# EAGLE design USBControlledAudioMixer (EAGLE 6.6.0)
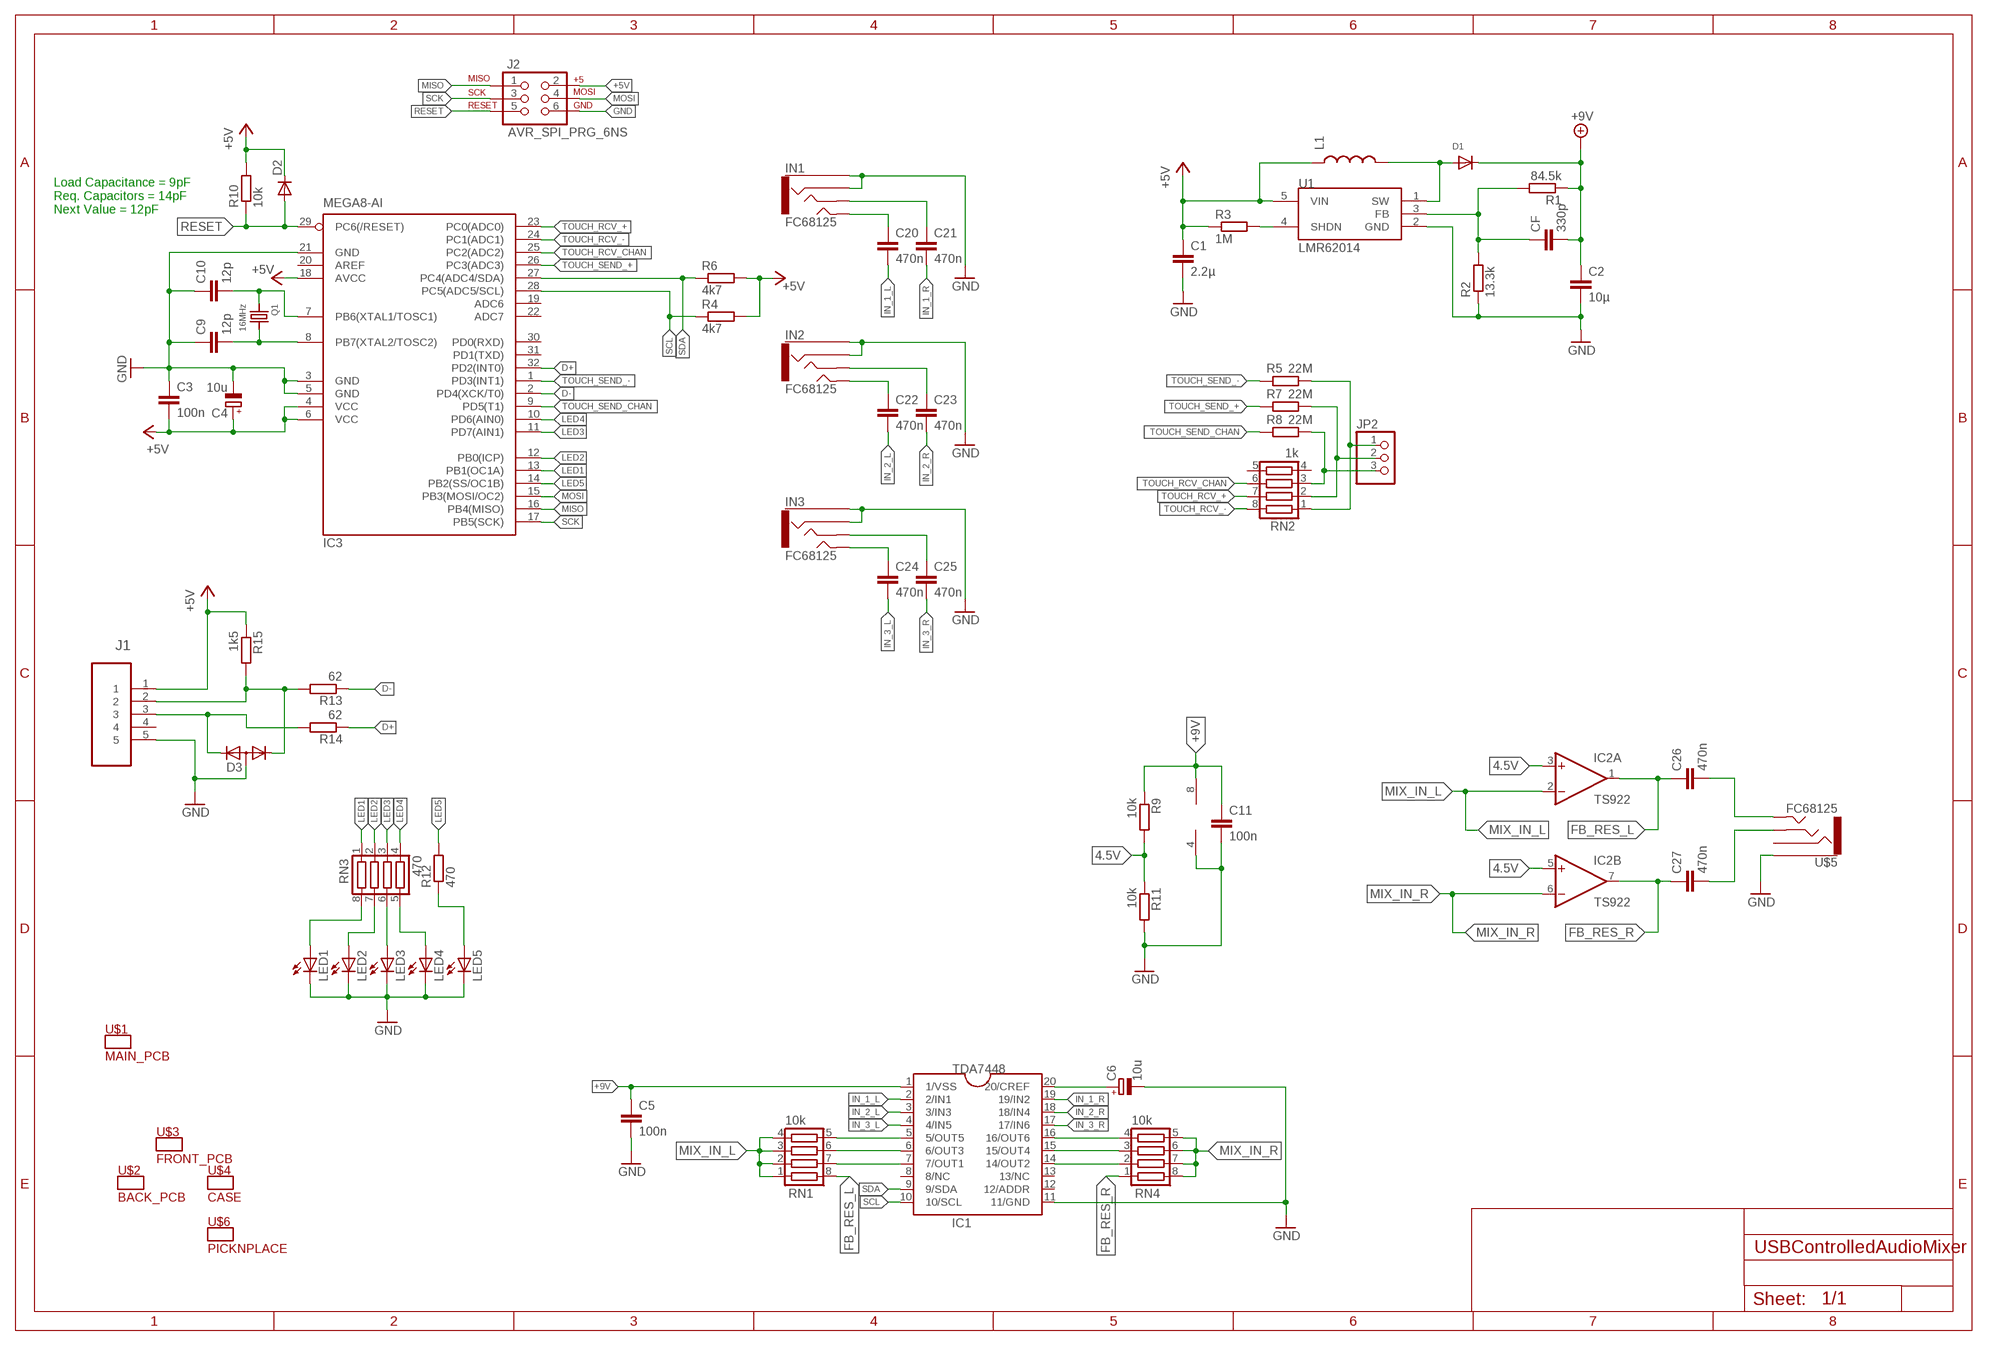
[diagram p0: schematic, sheet 1]
U$1 (DUMMY): PRICE_100: 2
U$2 (DUMMY): PRICE_100: 2
U$3 (DUMMY): PRICE_100: 2
U$4 (DUMMY): PRICE_100: 2
U$6 (DUMMY): PRICE_100: 5

## Parts
C1  2.2µ  C-EUC0603  [C0603]
C2  10µ  C-EUC0805  [C0805]
C3  100n  C-EUC0603  [C0603]
C4  10u  CPOL-EUSMCA  [SMC_A]
C5  100n  C-EUC0603  [C0603]
C6  10u  CPOL-EUSMCA  [SMC_A]
C9  12p  C-EUC0603  [C0603]
C10  12p  C-EUC0603  [C0603]
C11  100n  C-EUC0603  [C0603]
C20  470n  C-EUC1206  [C1206]
C21  470n  C-EUC1206  [C1206]
C22  470n  C-EUC1206  [C1206]
C23  470n  C-EUC1206  [C1206]
C24  470n  C-EUC1206  [C1206]
C25  470n  C-EUC1206  [C1206]
C26  470n  C-EUC1206  [C1206]
C27  470n  C-EUC1206  [C1206]
CF  330p  C-EUC0603  [C0603]
D1  DIODESOD-123  [SOD-123]
D2  DIODE-SOD323-R  [SOD323-R]
D3  DIODE-2CA|ACSOT23  [SOT23]
IC1  TDA7448  [SO20]
IC2  TS922  LM358D  [SO08]
IC3  MEGA8-AI  [TQFP32-08]
IN1  FC68125  [FC68125]
IN2  FC68125  [FC68125]
IN3  FC68125  [FC68125]
J1  47346-0001  [MOLEX_47346-0001]
J2  AVR_SPI_PRG_6NS  [2X3-NS]
JP2  PINHD-1X3  [1X03/90_MOLEX_4094]
L1  INDUCTOR1007  [1007]
LED1  LED0603  [LED-0603]
LED2  LED0603  [LED-0603]
LED3  LED0603  [LED-0603]
LED4  LED0603  [LED-0603]
LED5  LED0603  [LED-0603]
Q1  16MHz  CRYSTALTHIN  [CRYSTAL_3.2X2.5]
R1  84.5k  R-EU_R0603  [R0603]
R2  13.3k  R-EU_R0603  [R0603]
R3  1M  R-EU_R0603  [R0603]
R4  4k7  R-EU_R0603  [R0603]
R5  22M  R-EU_R0603  [R0603]
R6  4k7  R-EU_R0603  [R0603]
R7  22M  R-EU_R0603  [R0603]
R8  22M  R-EU_R0603  [R0603]
R9  10k  R-EU_R0603  [R0603]
R10  10k  R-EU_R0603  [R0603]
R11  10k  R-EU_R0603  [R0603]
R12  470  R-EU_R0603  [R0603]
R13  62  R-EU_R0603  [R0603]
R14  62  R-EU_R0603  [R0603]
R15  1k5  R-EU_R0603  [R0603]
RN1  10k  RES_ARR  [YC164]
RN2  1k  RES_ARR  [YC164]
RN3  470  RES_ARR  [YC164]
RN4  10k  RES_ARR  [YC164]
U1  LMR62014  [SOT-23]
U$5  FC68125  [FC68125]

## Nets
4.5V: IC2.3(A:+IN) IC2.5(B:+IN) R9.2 R11.1
+5V [supply]: C1.1 C3.2 C4.+ D2.C IC3.4(VCC) IC3.6(VCC) IC3.18(AVCC) J1.1 J2.2 L1.1 R3.1 R4.2 R6.2 R10.2 R15.1 U1.5(VIN)
+9V: C2.1 C5.1 C11.1 CF.2 D1.C IC1.1(1/VSS) IC2.8(P:V+) R1.1 R9.1
D+: IC3.32(PD2(INT0)) R14.1
D-: IC3.2(PD4(XCK/T0)) R13.1
FB: CF.1 R1.2 R2.2 U1.3(FB)
FB_RES_L: C26.1 IC2.1(A:OUT) RN1.8
FB_RES_R: C27.1 IC2.7(B:OUT) RN4.1
GND: C1.2 C2.2 C3.1 C4.- C5.2 C6.- C9.1 C10.1 C11.2 D3.3(A) IC1.11(11/GND) IC2.4(P:V-) IC3.3(GND) IC3.5(GND) IC3.21(GND) IN1.1 IN1.6 IN2.1 IN2.6 IN3.1 IN3.6 J1.5 J2.6 LED1.C LED2.C LED3.C LED4.C LED5.C R2.1 R11.2 U1.2(GND) U$5.1
IN_1_L: C20.2 IC1.2(2/IN1)
IN_1_R: C21.2 IC1.19(19/IN2)
IN_2_L: C22.2 IC1.3(3/IN3)
IN_2_R: C23.2 IC1.18(18/IN4)
IN_3_L: C24.2 IC1.4(4/IN5)
IN_3_R: C25.2 IC1.17(17/IN6)
LED1: IC3.13(PB1(OC1A)) RN3.1
LED2: IC3.12(PB0(ICP)) RN3.2
LED3: IC3.11(PD7(AIN1)) RN3.3
LED4: IC3.10(PD6(AIN0)) RN3.4
LED5: IC3.14(PB2(SS/OC1B)) R12.2
MISO: IC3.16(PB4(MISO)) J2.1
MIX_IN_L: IC2.2(A:-IN) RN1.1 RN1.2 RN1.3 RN1.4
MIX_IN_R: IC2.6(B:-IN) RN4.5 RN4.6 RN4.7 RN4.8
MOSI: IC3.15(PB3(MOSI/OC2)) J2.4
N$1: C6.+ IC1.20(20/CREF)
N$2: C9.2 IC3.8(PB7(XTAL2/TOSC2)) Q1.2
N$3: C10.2 IC3.7(PB6(XTAL1/TOSC1)) Q1.1
N$5: LED1.A RN3.8
N$6: LED2.A RN3.7
N$7: LED3.A RN3.6
N$8: LED4.A RN3.5
N$9: LED5.A R12.1
N$10: C24.1 IN3.2
N$11: D3.1(K1) J1.2 R13.2 R15.2
N$12: C25.1 IN3.3 IN3.3A
N$13: D3.2(K2) J1.3 R14.2
N$14: C22.1 IN2.2
N$15: C23.1 IN2.3 IN2.3A
N$16: C20.1 IN1.2
N$17: C21.1 IN1.3 IN1.3A
N$18: JP2.1 R5.2 RN2.1
N$19: JP2.2 R7.2 RN2.2
N$20: JP2.3 R8.2 RN2.3
N$21: IC1.5(5/OUT5) RN1.5
N$22: IC1.6(6/OUT3) RN1.6
N$23: C26.2 U$5.2
N$25: IC1.7(7/OUT1) RN1.7
N$26: C27.2 U$5.3 U$5.3A
N$27: IC1.16(16/OUT6) RN4.4
N$28: IC1.15(15/OUT4) RN4.3
N$29: IC1.14(14/OUT2) RN4.2
RESET: D2.A IC3.29(PC6(/RESET)) J2.5 R10.1
SCK: IC3.17(PB5(SCK)) J2.3
SCL: IC1.10(10/SCL) IC3.28(PC5(ADC5/SCL)) R4.1
SDA: IC1.9(9/SDA) IC3.27(PC4(ADC4/SDA)) R6.1
SHDN: R3.2 U1.4(SHDN)
SW: D1.A L1.2 U1.1(SW)
TOUCH_RCV_+: IC3.23(PC0(ADC0)) RN2.7
TOUCH_RCV_-: IC3.24(PC1(ADC1)) RN2.8
TOUCH_RCV_CHAN: IC3.25(PC2(ADC2)) RN2.6
TOUCH_SEND_+: IC3.26(PC3(ADC3)) R7.1
TOUCH_SEND_-: IC3.1(PD3(INT1)) R5.1
TOUCH_SEND_CHAN: IC3.9(PD5(T1)) R8.1
Unconnected: IC1.8(8/NC) IC1.12(12/ADDR) IC1.13(13/NC) IC3.19(ADC6) IC3.20(AREF) IC3.22(ADC7) IC3.30(PD0(RXD)) IC3.31(PD1(TXD)) J1.4 RN2.4 RN2.5 U$5.6

## Notes on the sheet
- Load Capacitance = 9pF
  Req. Capacitors = 14pF
  Next Value = 12pF

## Library data of the parts
C1 = rcl:C-EU: CAPACITOR, European symbol; OC_DIGIKEY: 1276-1821-1-ND; PRICE_100: 0.039
C2 = rcl:C-EU: CAPACITOR, European symbol; OC_DIGIKEY: 490-10498-1-ND; PRICE_100: 0.067
C3 C5 C11 = rcl:C-EU: CAPACITOR, European symbol; OC_DIGIKEY: 1276-1258-1-ND; PRICE_100: 0.008
C4 C6 = rcl:CPOL-EU: POLARIZED CAPACITOR, European symbol; OC_TME: T491A106M016AT; PRICE_100: 0.064
C9 C10 = rcl:C-EU: CAPACITOR, European symbol; OC_DIGIKEY: 1276-1254-1-ND; PRICE_100: 0.013
C20-C27 = rcl:C-EU: CAPACITOR, European symbol; OC_DIGIKEY: 338-2776-1-ND; PRICE_100: 0.487
CF = rcl:C-EU: CAPACITOR, European symbol; OC_DIGIKEY: 1276-2272-1-ND; PRICE_100: 0.02
D1 = adafruit:DIODE: Diode SMADIODE - SMA Surface Mount Package 20V 1A Schottky Diode Digikey: 641-1014-6-ND DO-1N4148 - Through Hole Small Current Diode SOD-123 20V 1 A (.5mV Vf) Schottky Diode - Digikey: MBRX120TPMSCT-ND SOD-323 10V 570mA (.38mV Vf, 3ns) Schottky Diode - Digikey: ZLLS410CT-ND SOD-523 30V 30mA Schottky Diode (RB751S-40TE61) - Digikey: RB751S-40TE61CT-ND SOT23-R/W - SOT23 Package (R = Solder Paste/Reflow Ovens, W = Hand-Soldering) BAT54Film 40V 300mA - Digikey: 497-7162-1-ND; OC_DIGIKEY: MBR0520LT1GOSCT-ND; PRICE_100: 0.18
D2 = diode:DIODE-: DIODE; OC_DIGIKEY: 497-10893-1-ND; PRICE_100: 0.092
D3 = diode:DIODE-2CA|AC: Dual DIODE Cathode-Anode|Anode-Cathode; OC_DIGIKEY: AZ23C3V6-TPMSCT-ND; PRICE_100: 0.16
IC1 = Audio-Power-amlifier V.2.0:TDA7448: The TDA7448 is a 6 channel volume controller for quality audio applications in Multi-Channels Audio Systems; OC_DIGIKEY: 497-8884-1-ND; PRICE_100: 2.35
IC2 = linear:LM358: OP AMP also LM158; LM258; LM2904 Source: http://cache.national.com/ds/LM/LM158.pdf; OC_DIGIKEY: 497-6035-1-ND; PRICE_100: 0.546
IC3 = atmel:MEGA8: MICROCONTROLLER 8 Kbytes FLASH, 1 kbytes SRAM, 512 bytes EEPROM, USART, 6-channel 10 bit ADC, 2-channel 8 bit ADC Pin compatible with Atmega48, ATMega88, ATMega168 Source: avr.lbr; MPN: ATMEGA8-16AU; OC_FARNELL: 9171371; OC_NEWARK: 73M8863; OC_TME: ATMEGA8-16AU; PRICE_100: 1.04
IN1-IN3 U$5 = FC68125:FC68125; OC_TME: FC68125; PRICE_100: 0.313
J1 = Molex-47346-0001:47346-0001: CONN RCPT 5POS MICRO USB R/A SMD; MPN: 47346-0001; OC_DIGIKEY: WM17141CT-ND; OC_FARNELL: 1568026; OC_NEWARK: 47M0505; PACKAGE: 5 POS MICRO USB R/A; PRICE_100: 0.74; SUPPLIER: MOLEX
J2 = SparkFun:AVR_SPI_PRG_6: AVR ISP 6 Pin This is the reduced ISP connector for AVR programming. Common on Arduino. This footprint will take up less PCB space and can be used with a 10-pin to 6-pin adapter such as SKU: BOB-08508
JP2 = TinyMix3:PINHD-1X3: PIN HEADER; OC_DIGIKEY: WM2734-ND; PRICE_100: 0.227
L1 = SparkFun:INDUCTOR: Inductors Basic Inductor/Choke - 0603 and 1206. Footprints are not proven and vary greatly between part numbers.; OC_DIGIKEY: 587-1613-1-ND; PRICE_100: 0.14
LED1-LED5 = SparkFun:LED: LEDs Standard schematic elements and footprints for 5mm, 3mm, 1206, and 0603 sized LEDs. 5mm - Spark Fun Electronics SKU : COM-00529 (and others); OC_TME: KPA-1606QBC-F; PRICE_100: 0.2511
Q1 = nonolith:CRYSTAL: Crystals HC49UP - Surface Mount Crystal 4.0MHz 18pF +/-30ppm Surface Mount Crystal [Digikey: 535-9857-1-ND] 12.0 MHz Surface Mount Crystal [Digikey: 535-9869-6-ND] 25.0 MHz Surface Mount Crystal [Digikey: 535-9078-1-ND] 3.2 x 2.5mm - MEMs SMT Crystal 12.0 MHz 8pF 15ppm 3.2 x 2.5mm Crystal [Digikey: 644-1047-1-ND] 16.0 MHz 8pF 15ppm 3.2 x 2.5mm Crystal [Digikey: 644-1049-1-ND] 16.0 MHz 10pF 10ppm 3.2 x 2.5mm Crystal [Digikey: 644-1100-1-ND] 27.12 MHz 18pF 30ppm 3.2 x 2.5mm Crystal [Digikey: 887-1424-1-ND] 4.9 x 1.8mm - MEMs SMT Crystal 32.768 KHz 12.5pF 20ppm 4.9 x 1.8mm Crystal [Digikey: SE2415CT-ND] Cylinder 32.768KHz Cylinder Crystal; OC_DIGIKEY: SER3628CT-ND; PRICE_100: 0.415
R1 = rcl:R-EU_: RESISTOR, European symbol; OC_DIGIKEY: RHM84.5KCFCT-ND; PRICE_100: 0.0048
R2 = rcl:R-EU_: RESISTOR, European symbol; OC_DIGIKEY: RHM13.3KCFCT-ND; PRICE_100: 0.0043
R3 = rcl:R-EU_: RESISTOR, European symbol; OC_DIGIKEY: RHM1MCGCT-ND; PRICE_100: 0.0043
R4 R6 = rcl:R-EU_: RESISTOR, European symbol; OC_DIGIKEY: RHM4.7KCGCT-ND; PRICE_100: 0.0043
R5 R7 R8 = rcl:R-EU_: RESISTOR, European symbol; OC_DIGIKEY: RMCF0603JT22M0CT-ND; PRICE_100: 0.0069
R9 R11 R15 = rcl:R-EU_: RESISTOR, European symbol; OC_DIGIKEY: RHM1.5KCGCT-ND; PRICE_100: 0.0043
R10 = rcl:R-EU_: RESISTOR, European symbol; OC_DIGIKEY: RHM10KCGCT-ND; PRICE_100: 0.0042
R12 = rcl:R-EU_: RESISTOR, European symbol; OC_DIGIKEY: RHM470CGCT-ND; PRICE_100: 0.0043
R13 R14 = rcl:R-EU_: RESISTOR, European symbol; OC_DIGIKEY: RHM62CGCT-ND; PRICE_100: 0.0043
RN1 RN4 = Simplex-rlc:RES_ARR: resistor chip array yageo YC164 series (8pin/4R); OC_DIGIKEY: YC164J-10KCT-ND; PRICE_100: 0.015
RN2 = Simplex-rlc:RES_ARR: resistor chip array yageo YC164 series (8pin/4R); OC_DIGIKEY: YC164J-1.0KCT-ND; PRICE_100: 0.015
RN3 = Simplex-rlc:RES_ARR: resistor chip array yageo YC164 series (8pin/4R); OC_DIGIKEY: YC164J-470CT-ND; PRICE_100: 0.015
U1 = projectLibrary:LMR62014; OC_DIGIKEY: LMR62014XMF/NOPBCT-ND; PRICE_100: 1.269

## Net classes
1 supply: width 0.254 mm

## Board
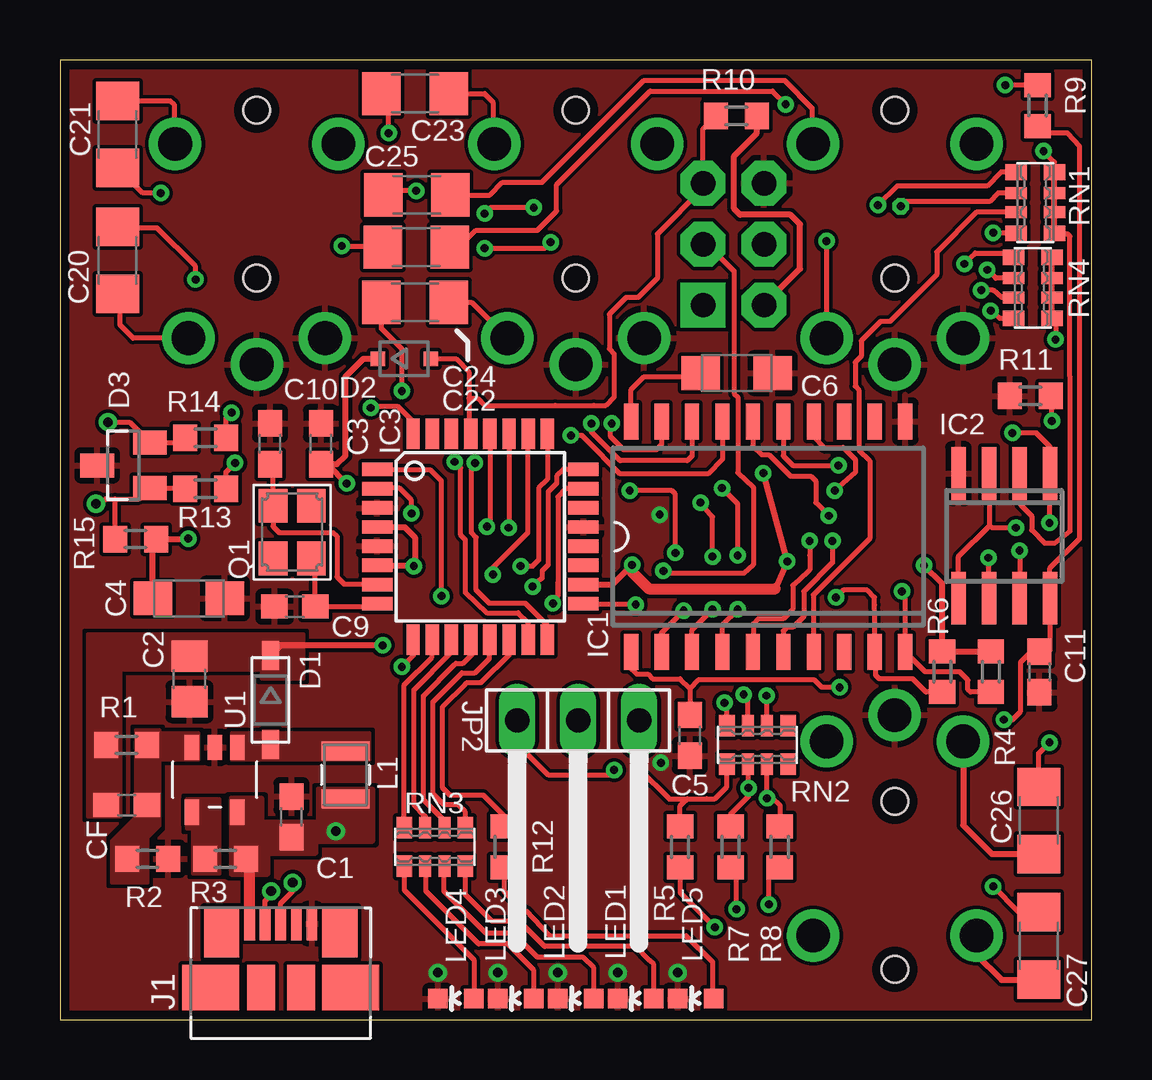
[diagram p1: board, top side]
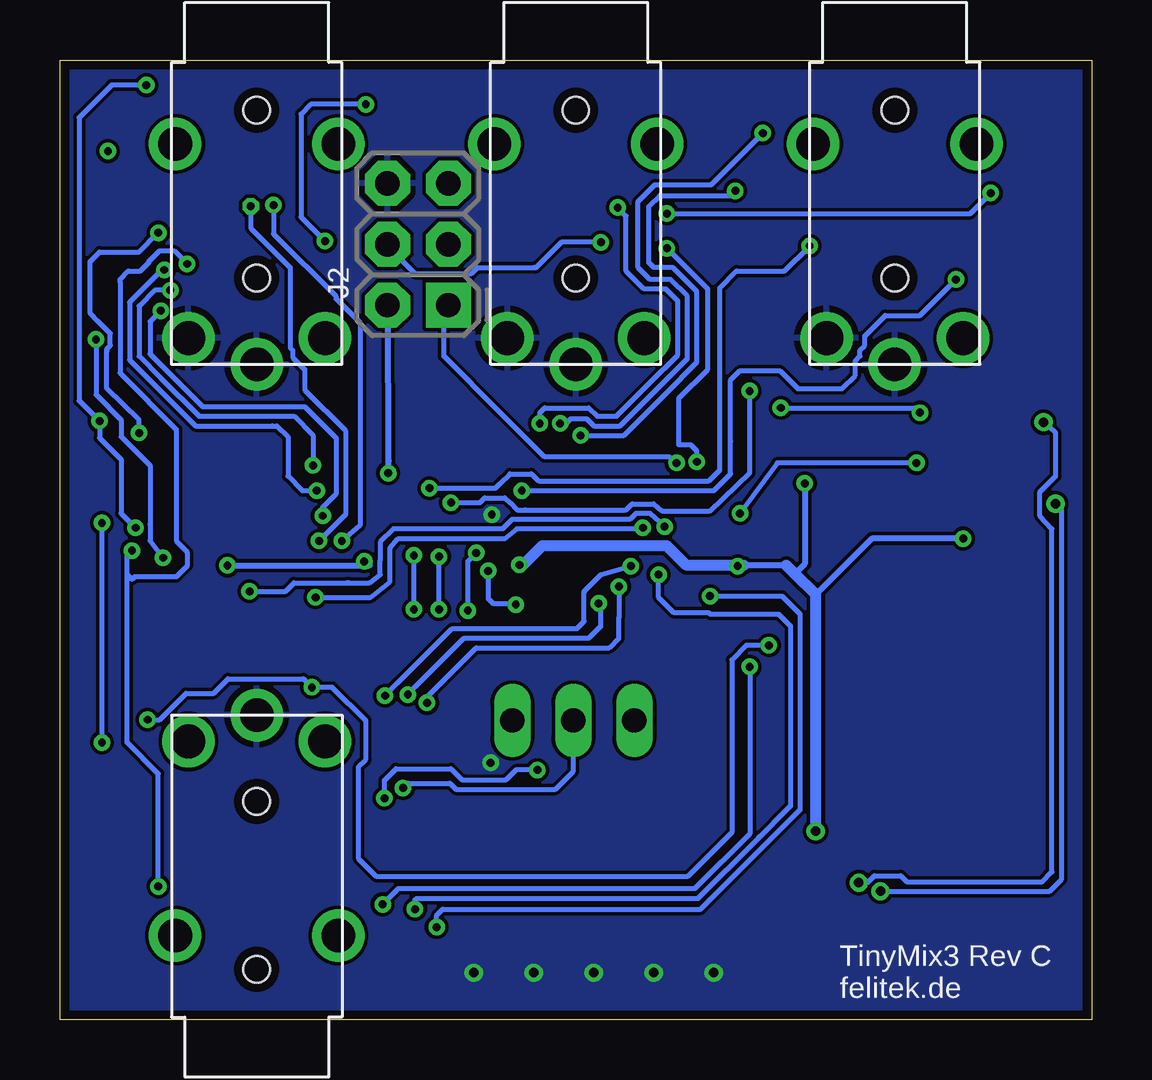
[diagram p2: board, bottom side, seen from below]

Size 43 x 40 mm. Coordinates in mm from the lower left corner, seen from the top.
Outline: 0,0 43,0 43,40 0,40 0,0
Copper layers (1*16): Top 0.0356mm / dielectric 1.5011mm / Bottom 0.0356mm
Design rules "LaenPCBOrder": minimum track width 6mil, minimum drill 13mil, track to track 6mil, track to pad 6mil, pad to pad 6mil, via to via 6mil, smd to smd 6mil, copper to edge 15mil, drill to drill 6mil, minimum pad ring 7mil, minimum via ring 7mil, stop-mask expansion 3mil, vias tented up to drill 0mil, thermal gap 10mil
tKeepout: area 0,0 to 1,40; area 42,0 to 43,40
bKeepout: area 0,0 to 1,40; area 42,0 to 43,40

### Footprints (pad centres in the part's own frame; a part is rotated, then mirrored left to right if it is on the bottom)
C0603 = smd 1.1 x 1: 1 -0.85,0; 2 0.85,0
C0805 = smd 1.3 x 1.5: 1 -0.95,0; 2 0.95,0
SMC_A = smd 1.6 x 1.4: + -1.5,0; - 1.5,0
C1206 = smd 1.6 x 1.8: 1 -1.4,0; 2 1.4,0
SOD-123 = smd 1.2 x 0.7: A 1.85,0; C -1.85,0
SOD323-R = smd 0.6 x 0.6: A 1.1,0; C -1.1,0
SOT23 = smd 1 x 1.4: 1 -0.95,-1.1; 2 0.95,-1.1; 3 0,1.1
SO20 = smd 0.6 x 1.5: 1 -5.715,-4.8; 2 -4.445,-4.8; 3 -3.175,-4.8; 4 -1.905,-4.8; 5 -0.635,-4.8; 6 0.635,-4.8; 7 1.905,-4.8; 8 3.175,-4.8; 9 4.445,-4.8; 10 5.715,-4.8; 11 5.715,4.8; 12 4.445,4.8; 13 3.175,4.8; 14 1.905,4.8; 15 0.635,4.8; 16 -0.635,4.8; 17 -1.905,4.8; 18 -3.175,4.8; 19 -4.445,4.8; 20 -5.715,4.8
SO08 = smd 0.6 x 2.2: 1 -1.905,-2.6; 2 -0.635,-2.6; 3 0.635,-2.6; 4 1.905,-2.6; 5 1.905,2.6; 6 0.635,2.6; 7 -0.635,2.6; 8 -1.905,2.6
TQFP32-08 = smd 1.27 x 0.559: 1 -4.293,2.8; 2 -4.293,2; 3 -4.293,1.2; 4 -4.293,0.4; 5 -4.293,-0.4; 6 -4.293,-1.2; 7 -4.293,-2; 8 -4.293,-2.8; 17 4.293,-2.8; 18 4.293,-2; 19 4.293,-1.2; 20 4.293,-0.4; 21 4.293,0.4; 22 4.293,1.2; 23 4.293,2; 24 4.293,2.8 | smd 0.559 x 1.27: 9 -2.8,-4.293; 10 -2,-4.293; 11 -1.2,-4.293; 12 -0.4,-4.293; 13 0.4,-4.293; 14 1.2,-4.293; 15 2,-4.293; 16 2.8,-4.293; 25 2.8,4.293; 26 2,4.293; 27 1.2,4.293; 28 0.4,4.293; 29 -0.4,4.293; 30 -1.2,4.293; 31 -2,4.293; 32 -2.8,4.293
FC68125 = drill 1.4 pad 2.184: 1 0,-6.35; 2 2.85,-5.25; 3 -3.4,2.85; 3A 3.4,2.85; 6 -2.85,-5.25 | hole 1.1: 0,4.25; 0,-2.75
MOLEX_47346-0001 = smd 0.45 x 1.38: 1 -1.3,0; 2 -0.65,0; 3 0,0; 4 0.65,0; 5 1.3,0 | smd 1.475 x 2.1: M1 -2.462,-0.36; M2 2.462,-0.36 | smd 2.375 x 1.9: M3 -2.913,-2.66; M6 2.913,-2.66 | smd 1.175 x 1.9: M4 -0.82,-2.66; M5 0.85,-2.66
2X3-NS = drill 1.016 pad 1.88 square: 1 -2.54,-1.27 | drill 1.016 pad 1.88 octagon: 2 -2.54,1.27; 3 0,-1.27; 4 0,1.27; 5 2.54,-1.27; 6 2.54,1.27
1X03/90_MOLEX_4094 = drill 1.016 long: 1 -2.54,-4.445; 2 0,-4.445; 3 2.54,-4.445
1007 = smd 2 x 0.8: 1 0,1; 2 0,-1
LED-0603 = smd 0.8 x 0.8: A 0,-0.75; C 0,0.75
CRYSTAL_3.2X2.5 = smd 1.4 x 1.2: 1 -1.1,-0.8; 2 1.1,0.8; GND1 -1.1,0.8; GND2 1.1,-0.8
R0603 = smd 1 x 1.1: 1 -0.85,0; 2 0.85,0
YC164 = smd 0.65 x 0.9: 1 -1.275,-0.8; 4 1.275,-0.8; 5 1.275,0.8; 8 -1.275,0.8 | smd 0.5 x 0.9: 2 -0.4,-0.8; 3 0.4,-0.8; 6 0.4,0.8; 7 -0.4,0.8
SOT-23 = smd 0.6 x 1.05: 1 -1,-1.4; 2 -0.05,-1.4; 3 0.9,-1.4; 4 0.9,1.3; 5 -1,1.3

### Placement (x,y rotation side)
C1  9.65,8.45 90 top
C2  5.4,14.2 270 top
C3  10.88,24 270 top
C4  5.37,17.56 0 top
C5  26.25,11.85 270 top
C6  28.2,26.95 0 top
C9  9.79,17.21 0 top
C10  8.75,24 270 top
C11  40.83,14.49 270 top
C20  2.4,31.65 90 top
C21  2.4,36.9 270 top
C22  14.8,29.9 180 top
C23  14.8,38.6 180 top
C24  14.85,32.2 180 top
C25  14.88,34.38 180 top
C26  40.8,8.3 270 top
C27  40.8,3.08 270 top
CF  2.77,8.95 180 top
D1  8.78,13.32 270 top
D2  14.35,27.55 0 top
D3  2.65,23.1 90 top
IC1  29.52,20.13 0 top
IC2  39.36,20.16 180 top
IC3  17.52,20.13 0 top
IN1  8.2,33.66 0 bottom
IN2  21.5,33.66 0 bottom
IN3  34.8,33.66 0 bottom
J1  9.2,4 0 top
J2  28.08,32.32 90 bottom
JP2  21.6,8.03 180 top
L1  11.9,10.2 180 top
LED1  24,0.88 90 top
LED2  21.5,0.88 90 top
LED3  19,0.88 90 top
LED4  16.5,0.88 90 top
LED5  26.5,0.88 90 top
Q1  9.68,20.32 270 top
R1  2.77,11.45 0 top
R2  3.65,6.7 180 top
R3  6.9,6.7 180 top
R4  38.8,14.5 90 top
R5  25.85,7.2 90 top
R6  36.77,14.5 90 top
R7  27.95,7.2 90 top
R8  30,7.2 90 top
R9  40.75,38.1 90 top
R10  28.2,37.66 0 top
R11  40.45,26 180 top
R12  18.5,7.2 90 top
R13  6.08,22.12 180 top
R14  6.08,24.25 180 top
R15  3.15,20.02 180 top
RN1  40.65,34.05 90 top
RN2  29.07,11.45 0 top
RN3  15.62,7.2 180 top
RN4  40.55,30.5 270 top
U1  6.4,9.95 180 top
U$5  34.8,6.34 180 bottom

### Tracks (layer width: path | path; a pad name or v marks a point on that pad's centre or on a via)
4.5V  (via drill 0.33)
  Top 0.203: IC2.5 37.45,19.3 38.75,20.6 | R9.2 v39.4,38.95 | v41.35,24.95 41.35,25.45 R11.1 | 38.75,20.6 38.75,22.73 IC2.3 | v39.85,20.5 38.85,20.5 38.75,20.6
  Bottom 0.203: v39.4,38.95 40.85,38.95 42.2,37.6 42.2,25.8 v41.35,24.95 41.35,24.25 40.45,23.35 40.45,21.1 v39.85,20.5
+5V  (via drill 0.33, 0.4)
  Top 0.254: IC3.18 23.03,18.13 v23.85,18.95 | IC3.6 13.26,18.9 v14.75,18.9 14.8,18.95 14.8,20.1 14.37,20.53 IC3.4 | C4.+ 3.87,19.89 R15.1 5.33,20.02 v5.35,20.05 | C3.2 11.15,23.15 | 11.15,23.15 v11.95,22.35 | J2.2 29.35,29.8 30.85,31.3 30.85,33.15 30.45,33.55 28.35,33.55 28.1,33.8 28.1,36 29.05,36.95 R10.2 | 29.82,17.95 v30.32,19.1 v29.32,22.78 | v36.02,18.93 36.77,18.18 R6.2 R4.2 | 11.15,23.15 11.55,23.15 11.9,23.5 11.9,26.35 11.9,26.8 12.65,27.55 D2.C
  Top 0.457: J1.1 7.9,6.55 R3.1 | v23.85,18.95 23.85,18.65 24.55,17.95 29.82,17.95
  Bottom 0.254: 12.72,18.93 14.5,18.93 14.53,18.9 v14.75,18.9 | v11.95,22.35 11.95,19 12.37,18.58 | v5.35,20.05 9.16,20.05 11.5,17.71 | v29.32,22.78 29.3,23.3 29.32,29.75 J2.2 | v36.02,18.93 30.09,18.93 v30.32,19.1
  Bottom 0.457: v11.5,7.85 11.5,17.71 12.37,18.58 12.72,18.93 | 14.5,18.93 16.88,18.93 17.7,19.75 22.9,19.75 23.7,18.95 23.73,18.93 v23.85,18.95
  pour Top (no thermals): 8.4,9.2 7.15,9.2 7.15,6.08 8.65,6.08 8.65,6.95 10.65,6.95 10.65,7.45 13.03,7.45 13.03,9.57 10.78,9.57 10.78,8.2 8.4,8.2
+9V  (via drill 0.33)
  Top 0.203: v32.5,13.85 31.75,13.85 31.45,14.15 26.6,14.15 26.25,13.8 | 26.25,13.8 C5.1 | R9.1 40.8,36.95 42,36.95 42.5,36.4 42.5,20.05 41.27,18.82 IC2.8 41.27,15.4 C11.1 41.27,15.4 40.55,15.4 40.05,14.9 40.05,12.85 39.7,12.5 v39.35,12.5 | 23.7,14.95 23.7,14.75 24.05,14.4 24.5,14.4 24.7,14.2 25.85,14.2 26.25,13.8
  Top 0.254: IC1.1 23.73,15.33 23.7,14.95 23.62,14.88 | v13.45,15.6 9.2,15.6 D1.C
  Bottom 0.203: v39.35,12.5 38.85,12.5 37.75,13.6 36.6,13.6 36,14.2 32.85,14.2 v32.5,13.85 31.65,13.85 30.25,12.45 30.25,10.85 30.55,10.55 30.55,6.7 29.8,5.95 16.85,5.95 15,7.8 15,15 14.4,15.6 v13.45,15.6
  pour Top (no thermals): 2.52,8.45 1.15,8.45 1.15,16.07 10.15,16.07 10.15,14.2 8.4,14.2 8.4,14.57 2.52,14.57
D+  (via drill 0.33)
  Top 0.203: R14.1 6.92,25.07 v7.15,25.3 | IC3.32 14.7,24.44 14.7,24.95 14.1,25.55 13,25.55 v12.95,25.5
  Bottom 0.203: v12.95,25.5 7.35,25.5 v7.15,25.3
D-  (via drill 0.33)
  Top 0.203: R13.1 6.92,22.82 v7.3,23.2 | 13.25,22.15 IC3.2 13.25,22.15 | v14.65,21.1 14.65,21.65 14.15,22.15 13.25,22.15
  Bottom 0.203: v7.3,23.2 13.1,23.2 v14.65,21.1
FB
  pour Top (no thermals): 3.65,5.7 3.65,7.58 4.15,8.07 4.15,10.82 5.78,10.82 5.78,11.95 4.15,11.95 4.15,12.07 3.15,12.07 3.15,8.45 2.15,7.45 2.15,5.7
FB_RES_L  (via drill 0.33)
  Top 0.203: C26.1 40.8,11.1 v41.25,11.55 | v41.25,20.7 41.25,22.75 IC2.1 41.27,23.89 40.7,24.45 v39.7,24.45 | v38.9,32.8 39.83,32.8 RN1.8
  Bottom 0.203: v41.25,11.55 v41.25,20.7 | v39.7,24.45 39.7,25 41.05,26.3 41.05,27.85 41.05,27.95 40.9,28.1 40.9,28.6 41.4,29.1 41.75,29.45 41.75,31.6 41.35,32 39.7,32 v38.9,32.8
FB_RES_R  (via drill 0.33)
  Top 0.203: C27.1 39.98,4.47 v38.9,5.55 | v40,19.55 40,19.57 IC2.7 | v37.7,31.5 37.98,31.77 38.15,31.95 39.58,31.95 RN4.1
  Bottom 0.203: v38.9,5.55 38.9,10.25 40.2,11.55 40.2,18.55 | 40.2,18.55 40.2,19.35 v40,19.55 | 40.2,18.55 40,18.35 39.9,18.45 38.15,18.45 37.7,18.9 37.7,19.5 38.15,19.95 38.15,24.6 40.5,26.95 40.5,30.75 40.5,30.85 40.15,31.2 39.65,31.2 39.3,31.55 39.3,31.6 38.85,32.05 38.25,32.05 v37.7,31.5
GND  (via drill 0.33, 0.4)
  other vias: 15.75,1.95 18.25,1.95 20.75,1.95 23.25,1.95 25.75,1.95 25.05,10.7 25,21.05
  pour Bottom (rank 3): 0,0 43.18,0 43.18,40.64 0,40.64
  pour Top (rank 3): 0,0 43.18,0 43.18,40.64 0,40.64
IN_1_L  (via drill 0.33)
  Top 0.203: IC1.2 25.07,16.12 v26,17.05 | v25.65,19.45 25.65,21.15 25.65,21.9 25.5,22.05 v23.75,22.05 | v5.65,30.85 5.65,31.4 4.05,33 2.45,33 C20.2
  Bottom 0.203: v26,17.05 26,19.1 v25.65,19.45 | v23.75,22.05 23.3,22.05 15.75,22.05 15.05,22.75 15.05,24.1 15.05,26.65 14.65,27.05 13,27.05 12.25,26.3 10.4,26.3 9.85,26.85 9.85,27.45 9.65,27.65 9.65,27.9 9.45,28.1 9.45,28.5 8.6,29.35 7.15,29.35 v5.65,30.85
IN_1_R  (via drill 0.33)
  Top 0.203: IC1.19 25.07,23.98 24.85,23.75 23.5,23.75 22.95,24.3 22.95,24.7 v23,24.85 | v19.75,33.85 17.95,33.85 v17.7,33.6 | v4.2,34.45 3.45,34.45 C21.2
  Bottom 0.203: v23,24.85 23,25.3 22.8,25.5 20.95,25.5 20.6,25.15 19.8,25.15 18.4,26.55 17.25,27.7 17.25,29.95 17.75,30.45 18.65,30.45 19.3,31.1 19.4,31.2 19.4,33.5 v19.75,33.85 | v17.7,33.6 5.05,33.6 v4.2,34.45
IN_2_L  (via drill 0.33)
  Top 0.203: IC1.3 26.34,16.25 v27.2,17.1 | v27.2,19.3 27.2,20.95 v26.7,21.55 | v14.25,26.2 14.25,27.95 13.4,28.8 C22.2
  Bottom 0.203: v27.2,17.1 v27.2,19.3 | v26.7,21.55 25.5,21.55 25.3,21.75 24.45,21.75 24.25,21.55 23.95,21.25 23.6,21.25 19.4,21.25 19.15,21.5 18.25,21.5 17.9,21.2 15.9,21.2 14.25,22.8 14.25,25.65 v14.25,26.2
IN_2_R  (via drill 0.33)
  Top 0.203: IC1.18 26.34,23.5 26.15,23.3 23.35,23.3 22.4,24.25 22.15,24.5 v22.15,24.85 | v13.7,36.95 13.7,38.3 C23.2
  Bottom 0.203: v22.15,24.85 21.9,24.85 21.7,25.05 21.05,25.05 20.75,24.75 19.65,24.75 18.1,26.3 16.85,27.55 16.85,30.15 17.55,30.85 18.4,30.85 18.9,31.35 18.9,34.1 18.2,34.8 15.85,34.8 v13.7,36.95
IN_3_L  (via drill 0.33)
  Top 0.203: IC1.4 27.61,16.46 v28.25,17.1 | v28.25,19.35 28.25,21.5 v27.6,22.15 | v11.75,32.25 13.4,32.25 C24.2
  Bottom 0.203: v28.25,17.1 v28.25,19.35 | v27.6,22.15 24.85,22.15 24.65,22.35 24.25,22.75 23.35,22.75 23.05,22.45 15.95,22.45 15.5,22.9 15.5,24.1 15.5,30.5 14.8,31.2 12.8,31.2 v11.75,32.25
IN_3_R  (via drill 0.33)
  Top 0.203: IC1.17 27.61,23.36 27,22.75 23.35,22.75 21.95,24.15 21.75,24.35 v21.3,24.35 | v14.85,34.55 13.65,34.55 C25.2
  Bottom 0.203: v21.3,24.35 19.5,24.35 17.75,26.1 16.45,27.4 16.45,30.35 17.2,31.1 17.45,31.35 18.25,31.35 18.45,31.55 18.45,33.9 18,34.35 15.05,34.35 v14.85,34.55
LED1
  Top 0.203: RN3.1 16.9,8.65 16.6,8.95 16,8.95 15.55,9.4 15.55,13.25 16.75,14.45 17.3,14.45 17.9,15.05 17.9,15.6 17.9,15.82 IC3.13
LED2
  Top 0.203: RN3.2 16.02,8.28 15.15,9.15 15.15,13.5 16.45,14.8 16.5,14.85 16.8,14.85 17.2,15.25 17.2,15.55 17.15,15.81 IC3.12
LED3
  Top 0.203: RN3.3 15.23,8.47 14.75,8.95 14.75,13.75 16.3,15.3 16.3,15.82 IC3.11
LED4
  Top 0.203: RN3.4 14.35,13.95 15.5,15.1 15.5,15.82 IC3.10
LED5
  Top 0.203: R12.2 18.5,8.5 17.65,9.35 16.25,9.35 15.95,9.65 15.95,13.05 16.9,14 16.95,14.05 17.55,14.05 18.75,15.25 18.75,15.85 18.75,15.81 IC3.14
MISO  (via drill 0.33)
  Top 0.203: IC3.16 20.32,16.43 19.4,17.35 17.9,17.35 17.35,17.9 17.35,20.1 17.15,20.3 17.15,23.05 17.15,23.1 v17.3,23.2
  Bottom 0.203: v17.3,23.2 17.35,23.2 17.6,23.45 22.8,23.45 24.65,25.3 27,27.65 27,29.59 J2.1
MIX_IN_L  (via drill 0.33)
  Top 0.203: RN1.4 41.45,35.75 v41,36.2 | IC2.2 40.05,22.7 40.05,21.45 40.5,21 40.5,20.4 41.05,19.85 41.45,19.85 42.1,20.35 42.1,26.8 42.1,32.65 42,32.75 41.48,32.75 RN1.1
  Top 0.254: RN1.1 RN1.2 RN1.3 RN1.4
MIX_IN_R  (via drill 0.33)
  Top 0.203: RN4.5 41.5,29.1 v41.5,28.35 | v38.7,19.25 38.7,19.09 IC2.6
  Top 0.254: RN4.5 RN4.6 RN4.7 RN4.8
  Bottom 0.203: v41.5,28.35 41.5,26.05 40.45,25 40.45,24.3 39.25,23.1 39.25,20.65 39.25,19.95 v38.7,19.25
MOSI  (via drill 0.33)
  Top 0.203: IC3.15 19.5,15.86 19.5,16.55 19.1,16.95 17.8,16.95 16.9,17.8 16.9,20 16.7,20.2 16.7,23 v16.45,23.25 | v17.7,32.15 20.2,32.15 v20.45,32.4
  Bottom 0.203: J2.4 29.35,32.25 28.2,31.1 25.85,31.1 25.6,31.35 23.25,31.35 23.15,31.35 22.1,32.4 v20.45,32.4 | v16.45,23.25 16.45,23.7 16.7,23.95 17.2,23.95 17.2,25.9 16,27.1 16,30.45 17.2,31.65 v17.7,32.15
N$1
  Top 0.203: IC1.20 23.8,26.25 24.35,26.8 26.55,26.8 C6.+
N$2
  Top 0.203: IC3.8 13.11,17.21 C9.2 10.64,19.06 Q1.2
N$3
  Top 0.203: IC3.7 13.21,18.15 11.84,18.15 11.54,18.45 11.54,20.15 11.39,20.3 9.14,20.3 8.88,20.56 Q1.1 8.88,23.02 C10.2
N$5
  Top 0.203: LED1.A 24.75,2.3 24.6,2.45 24,3.05 20.2,3.05 19.15,4.1 18,4.1 16.9,5.2 RN3.8
N$6
  Top 0.203: LED2.A 22.25,2.15 21.8,2.6 19.9,2.6 18.9,3.6 17.75,3.6 16,5.35 16,6.38 RN3.7
N$7
  Top 0.203: LED3.A 19.75,2.05 18.65,3.15 17.45,3.15 15.25,5.35 15.25,6.38 RN3.6
N$8
  Top 0.203: RN3.5 14.35,5.4 17.25,2.5 LED4.A
N$9
  Top 0.203: R12.1 18.5,5.35 19.3,4.55 19.4,4.55 20.4,3.5 26.1,3.5 27.2,2.4 27.2,0.93 LED5.A
N$10  (via drill 0.33)
  Top 0.203: C24.1 16.65,32.2 17.35,32.9 19.9,32.9 20.7,33.7 20.7,34.8 24.6,38.7 29.7,38.7 v30.25,38.15 | v31.95,32.45 IN3.2
  Bottom 0.203: v30.25,38.15 32.55,38.15 32.95,37.75 32.95,33.45 v31.95,32.45
N$11  (via drill 0.4)
  Top 0.203: J1.2 8.55,4.45 8.55,4.95 8.8,5.2 v8.8,5.35 | v1.5,21.5 1.7,21.5 1.9,21.7 2.3,21.7 | 2.3,21.7 3.3,21.7 D3.1 5.2,22.15 R13.2 | R15.2 2.3,21.7
  Bottom 0.203: v8.8,5.35 1.75,5.35 1.25,5.85 1.25,21.25 v1.5,21.5
N$12
  Top 0.203: C25.1 17.93,34.38 18.45,34.9 20.1,34.9 24.35,39.15 30.2,39.15 31.35,38 31.35,36.55 IN3.3A
N$13  (via drill 0.4)
  Top 0.203: J1.3 9.2,4.85 9.7,5.35 v9.7,5.7 | v2,24.9 2.9,24.9 D3.2 5.08,24.05 R14.2
  Bottom 0.203: v9.7,5.7 9.35,5.7 9.05,6 7.95,6 7.7,5.75 2.05,5.75 1.65,6.15 1.65,20.45 2.15,21 2.15,22 1.5,22.65 1.5,24.45 v2,24.9
N$14
  Top 0.203: C22.1 17.16,29.9 IN2.2
N$15
  Top 0.203: C23.1 17.7,38.6 18.05,38.25 18.05,36.55 IN2.3A
N$16
  Top 0.203: IN1.2 3.04,28.41 2.5,28.95 2.5,30.15 C20.1
N$17
  Top 0.203: C21.1 4.6,38.3 4.75,38.15 4.75,36.55 IN1.3A
N$18
  Top 0.2: R5.2 25.85,8.9 25.98,9.02 26.15,9.2 26.95,9.2 27.3,9.2 27.8,9.7
  Top 0.203: 27.8,9.7 RN2.1 | JP2.1 24.14,10.46 25.4,9.2 25.8,9.2 26.95,9.2
N$19  (via drill 0.33)
  Top 0.2: R7.2 27.95,8.55 28.7,9.3 v28.7,9.65 28.7,10.62 RN2.2
  Bottom 0.203: v28.7,9.65 28.68,9.68 28.5,9.85 26.75,9.85 26.5,9.6 22.35,9.6 21.6,10.35 JP2.2
N$20  (via drill 0.33)
  Top 0.2: v29.48,9.23 29.72,9.23 30,8.95 R8.2
  Top 0.203: v29.48,9.23 RN2.3 | JP2.3 19.06,11.49 20.35,10.2 22.9,10.2 v23.1,10.4
  Bottom 0.203: v29.48,9.23 29.48,9.97 29,10.45 26.7,10.45 26.25,10 24.4,10 24,10.4 v23.1,10.4
N$21  (via drill 0.33)
  Top 0.203: RN1.5 39.23,35.33 38.65,34.75 34.9,34.75 v34.1,33.95 | IC1.5 28.9,15.35 28.9,16.5 29.1,16.7 30.15,16.7 30.55,17.1 30.55,18.1 30.8,18.3 31.25,18.75 31.25,19.35 v31.25,19.95
  Bottom 0.203: v34.1,33.95 34.1,32.75 31.5,30.15 31.5,30.05 30.5,29.05 30.5,20.6 v31.25,19.95
N$22  (via drill 0.33)
  Top 0.203: RN1.6 39.1,34.45 38.75,34.1 35.25,34.1 v35.05,33.9 | v32.2,19.95 32.2,19.05 31,17.85 31,16.8 30.55,16.35 30.3,16.35 30.15,16.2 IC1.6 30.2,15.38
  Bottom 0.203: v35.05,33.9 35.05,33 33.4,31.35 33.4,28 33.3,27.9 33.3,27.6 32.8,27.1 32.8,26.25 31.1,24.55 31.1,21.05 v32.2,19.95
N$23
  Top 0.254: U$5.2 37.65,8.1 38.85,6.9 C26.2
N$25
  Top 0.203: RN1.7 38.2,33.65 36.55,32 36.55,31.05 34.6,29.1 34.2,29.1 33.5,28.4 33.4,28.3 33.4,27.65 33.15,27.4 33.15,26.4 33.3,26.25 33.3,23.75 33.75,23.3 33.75,20.05 33.3,19.6 31.4,17.7 31.4,15.36 IC1.7
N$26
  Top 0.254: U$5.3A 38.2,2.7 39.25,1.65 40.77,1.65 C27.2
N$27  (via drill 0.33)
  Top 0.203: RN4.4 39.17,29.23 v38.8,29.55 | IC1.16 28.89,23.91 29.25,23.55 29.55,23.55 30.2,22.9 30.45,22.65 31.3,22.65 31.5,22.45 31.5,21.55 v32.05,21
  Bottom 0.203: v38.8,29.55 38.85,29.5 39.25,29.1 39.25,27.75 38.5,27 37.05,25.55 34.15,25.55 32.8,25.55 31.5,24.25 31.5,21.9 32.05,21.35 v32.05,21
N$28  (via drill 0.33)
  Top 0.203: RN4.3 39.25,30.1 38.9,30.4 v38.4,30.4 | IC1.15 30.16,23.5 30.55,23.1 v32.45,23.1
  Bottom 0.203: v38.4,30.4 39.05,30.4 39.7,29.75 39.7,27.65 38.8,26.75 37.2,25.15 34.15,25.15 33.25,25.15 32.45,24.35 v32.45,23.1
N$29  (via drill 0.33)
  Top 0.203: RN4.2 39,30.9 v38.65,31.25 | IC1.14 31.42,24.27 31.85,23.85 32.65,23.85 33.15,23.35 33.15,22.8 v32.3,22.05
  Bottom 0.203: v38.65,31.25 38.85,31.15 40.1,29.9 40.1,27.5 39.1,26.5 37.35,24.75 34.15,24.75 33.95,24.75 33.5,24.3 33.5,22.65 32.9,22.05 v32.3,22.05
RESET
  Top 0.203: R10.1 26.81,37.13 J2.5 26.81,34.66 24.9,32.75 24.9,30.9 24.1,30.1 23.6,30.1 22.9,29.4 22.9,27.95 23.1,27.75 23.1,25.95 22.75,25.6 22.25,25.6 20.65,25.6 17.7,25.6 17.4,25.9 17.05,25.9 | 17.05,25.9 17.05,24.49 IC3.29 | D2.A 16.5,27.55 17.05,27 17.05,25.9
SCK  (via drill 0.33)
  Top 0.203: v24,17.3 21.84,17.3 IC3.17 | J2.3 26.98,32.32 28.1,31.2 28.1,26.1 28.25,25.95 28.25,22.8 28.9,22.2 28.9,18.95 28.5,18.6 25.25,18.6 v25.15,18.7
  Bottom 0.203: v24,17.3 24.05,17.35 24.95,17.35 25.15,17.55 v25.15,18.7
SCL  (via drill 0.33)
  Top 0.203: R4.1 37.95,13.65 37.85,13.75 37.85,14.15 37.6,14.4 37.55,14.45 37.5,14.5 36.06,14.5 IC1.10 35.23,17.71 v35.1,17.85 | IC3.28 17.92,20.72 v17.8,20.55
  Bottom 0.203: v17.8,20.55 18.4,21.1 19,21.1 19.25,20.85 19.75,20.85 23.75,20.85 24.15,20.85 24.55,20.45 24.6,20.45 25.4,20.45 25.45,20.45 29.1,20.45 29.65,19.9 29.65,19.15 29.65,18.55 30.1,18.2 30.95,18.2 31.05,18.2 33.25,18.2 33.6,17.85 v35.1,17.85
SDA  (via drill 0.33)
  Top 0.203: R6.1 36.1,13.65 35.55,14.2 34.15,14.2 34,14.35 34,15.29 IC1.9 33.97,16.82 33.95,17.3 33.95,17.6 33.65,17.9 32.65,17.9 v32.35,17.6 | IC3.27 18.72,20.57 v18.7,20.5
  Bottom 0.203: v18.7,20.5 18.8,20.45 23.95,20.45 24.45,20.05 25.3,20.05 25.4,20.05 28,20.05 28.9,20.05 29.25,19.65 29.25,18.25 30.05,17.6 v32.35,17.6
SHDN
  pour Top (no thermals): 5.28,9.2 5.28,7.95 5.53,7.95 5.53,6.08 6.65,6.08 6.65,9.2
SW
  pour Top (no thermals): 12.9,10.82 7.15,10.82 7.15,11.95 12.9,11.95
TOUCH_RCV_+  (via drill 0.33)
  Top 0.203: IC3.23 21.08,22.13 20.75,21.8 20.75,18.2 | 20.75,18.2 20.75,17.65 | 20.75,17.65 20.75,18.2 | 20.75,18.2 20.75,17.65 | 20.75,17.65 v20.55,17.35 | RN2.7 28.68,13.38 v28.5,13.55
  Bottom 0.203: v28.5,13.55 28.45,13.6 28.15,13.9 26.15,15.9 20.95,15.9 20.45,16.4 20.45,17.25 v20.55,17.35
TOUCH_RCV_-  (via drill 0.33)
  Top 0.203: IC3.24 20.98,22.93 20.7,22.65 20.7,22.35 20.35,22 20.35,18.95 20.1,18.7 20.1,18.4 v19.7,18.05 | RN2.8 27.8,13.05 v27.7,13.2
  Bottom 0.203: v27.7,13.2 27.7,13.45 27.35,13.8 25.65,15.5 20.1,15.5 19.7,15.9 19.7,16.75 v19.7,18.05
TOUCH_RCV_CHAN  (via drill 0.33)
  Top 0.203: IC3.25 20.32,22.52 19.95,22.15 19.95,19.15 19.7,18.9 v19.2,18.9 | RN2.6 29.48,13.47 v29.45,13.5
  Bottom 0.203: v29.45,13.5 28.9,14.05 26.65,16.3 21.45,16.3 21.15,16.6 21.15,17.8 21.15,17.85 20.45,18.55 v19.2,18.9
TOUCH_SEND_+  (via drill 0.33)
  Top 0.2: v28.2,4.6 28.2,6.1 R7.1
  Top 0.203: v18.05,18.55 18.05,18.85 19.5,20.3 19.5,24.4 IC3.26
  Bottom 0.203: v28.2,4.6 28.2,5 28.15,5.05 16.4,5.05 14,7.45 | 14,7.45 13.8,7.65 | v18.05,18.55 18.05,17.6 17.4,16.95 15.95,16.95 15.9,16.9 13.05,16.9 12.55,16.4 12.55,8.9 14,7.45
TOUCH_SEND_-  (via drill 0.33)
  Top 0.2: R5.1 25.85,5.3 v27.3,3.85
  Top 0.203: v15.9,17.65 15.9,22.45 15.45,22.9 13.26,22.9 IC3.1
  Bottom 0.203: v27.3,3.85 27.3,4.35 27.05,4.6 16.3,4.6 13.35,7.55 12.15,8.75 12.15,16.9 12.9,17.65 v15.9,17.65
TOUCH_SEND_CHAN  (via drill 0.33)
  Top 0.2: v29.55,4.8 29.55,5.9 R8.1
  Top 0.203: IC3.9 14.72,15.17 v14.25,14.7
  Bottom 0.2: v29.55,4.8 28.95,5.4 28.9,5.45 28.85,5.45
  Bottom 0.203: v14.25,14.7 14.25,7.75 16.55,5.45 28.85,5.45

### Text on the board
bNames: TinyMix3 Rev C / felitek.de